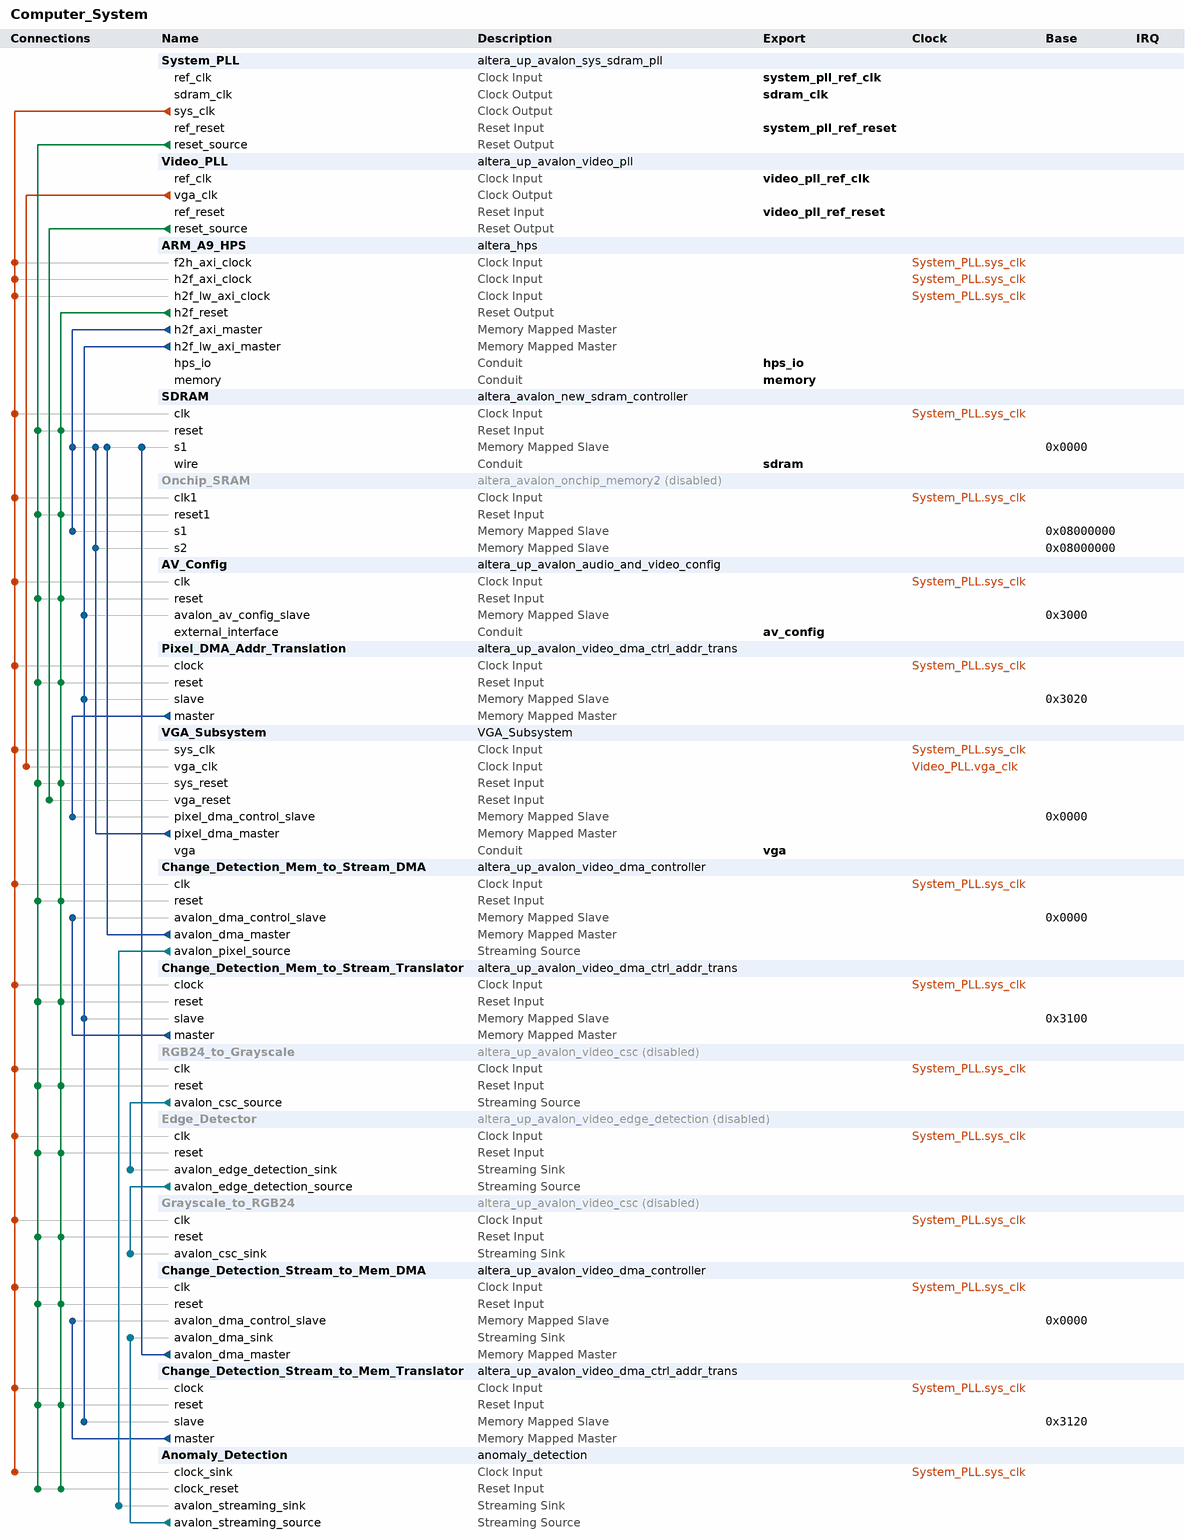
[diagram p0: system contents]
# Platform Designer (Qsys) system Computer_System, Cyclone V 5CSXFC6D6F31C6
# Parameters at their usual value, and those the tool derives, are not listed.
package require -exact qsys 18.0
create_system Computer_System
set_project_property DEVICE_FAMILY {Cyclone V}
set_project_property DEVICE 5CSXFC6D6F31C6

add_instance System_PLL altera_up_avalon_sys_sdram_pll 18.0
set_instance_parameter_value System_PLL CV_boards DE1-SoC
set_instance_parameter_value System_PLL gui_outclk 100.0
set_instance_parameter_value System_PLL gui_refclk 50.0

add_instance Video_PLL altera_up_avalon_video_pll 18.0
set_instance_parameter_value Video_PLL camera {5MP Digital Camera (THDB_D5M)}
set_instance_parameter_value Video_PLL gui_refclk 50.0
set_instance_parameter_value Video_PLL lcd {2.4" LCD on LT24}

add_instance ARM_A9_HPS altera_hps 18.1
set_instance_parameter_value ARM_A9_HPS EMAC1_Mode RGMII
set_instance_parameter_value ARM_A9_HPS EMAC1_PinMuxing {HPS I/O Set 0}
set_instance_parameter_value ARM_A9_HPS F2SCLK_COLDRST_Enable false
set_instance_parameter_value ARM_A9_HPS F2SCLK_DBGRST_Enable false
set_instance_parameter_value ARM_A9_HPS F2SCLK_WARMRST_Enable false
set_instance_parameter_value ARM_A9_HPS F2SINTERRUPT_Enable true
set_instance_parameter_value ARM_A9_HPS F2S_Width 2
set_instance_parameter_value ARM_A9_HPS FPGA_PERIPHERAL_OUTPUT_CLOCK_FREQ_EMAC0_GTX_CLK 100
set_instance_parameter_value ARM_A9_HPS FPGA_PERIPHERAL_OUTPUT_CLOCK_FREQ_EMAC0_MD_CLK 100.0
set_instance_parameter_value ARM_A9_HPS FPGA_PERIPHERAL_OUTPUT_CLOCK_FREQ_EMAC1_GTX_CLK 100
set_instance_parameter_value ARM_A9_HPS FPGA_PERIPHERAL_OUTPUT_CLOCK_FREQ_EMAC1_MD_CLK 100.0
set_instance_parameter_value ARM_A9_HPS HPS_PROTOCOL DDR3
set_instance_parameter_value ARM_A9_HPS I2C0_Mode I2C
set_instance_parameter_value ARM_A9_HPS I2C0_PinMuxing {HPS I/O Set 0}
set_instance_parameter_value ARM_A9_HPS I2C1_Mode I2C
set_instance_parameter_value ARM_A9_HPS I2C1_PinMuxing {HPS I/O Set 0}
set_instance_parameter_value ARM_A9_HPS LWH2F_Enable true
set_instance_parameter_value ARM_A9_HPS MEM_BANKADDR_WIDTH 3
set_instance_parameter_value ARM_A9_HPS MEM_CLK_FREQ 400.0
set_instance_parameter_value ARM_A9_HPS MEM_COL_ADDR_WIDTH 10
set_instance_parameter_value ARM_A9_HPS MEM_DQ_WIDTH 32
set_instance_parameter_value ARM_A9_HPS MEM_DRV_STR RZQ/6
set_instance_parameter_value ARM_A9_HPS MEM_ROW_ADDR_WIDTH 15
set_instance_parameter_value ARM_A9_HPS MEM_RTT_NOM RZQ/6
set_instance_parameter_value ARM_A9_HPS MEM_RTT_WR {Dynamic ODT off}
set_instance_parameter_value ARM_A9_HPS MEM_TCL 11
set_instance_parameter_value ARM_A9_HPS MEM_TFAW_NS 45.0
set_instance_parameter_value ARM_A9_HPS MEM_TRAS_NS 35.0
set_instance_parameter_value ARM_A9_HPS MEM_TRCD_NS 13.75
set_instance_parameter_value ARM_A9_HPS MEM_TRFC_NS 260.0
set_instance_parameter_value ARM_A9_HPS MEM_TRP_NS 13.75
set_instance_parameter_value ARM_A9_HPS MEM_VENDOR Micron
set_instance_parameter_value ARM_A9_HPS MEM_WTCL 7
set_instance_parameter_value ARM_A9_HPS QSPI_Mode {1 SS}
set_instance_parameter_value ARM_A9_HPS QSPI_PinMuxing {HPS I/O Set 0}
set_instance_parameter_value ARM_A9_HPS REF_CLK_FREQ 25.0
set_instance_parameter_value ARM_A9_HPS S2FCLK_USER2CLK 5
set_instance_parameter_value ARM_A9_HPS S2F_Width 2
set_instance_parameter_value ARM_A9_HPS SDIO_Mode {4-bit Data}
set_instance_parameter_value ARM_A9_HPS SDIO_PinMuxing {HPS I/O Set 0}
set_instance_parameter_value ARM_A9_HPS SPIM0_Mode {Single Slave Select}
set_instance_parameter_value ARM_A9_HPS SPIM0_PinMuxing {HPS I/O Set 0}
set_instance_parameter_value ARM_A9_HPS SPIM1_Mode {Single Slave Select}
set_instance_parameter_value ARM_A9_HPS SPIM1_PinMuxing {HPS I/O Set 0}
set_instance_parameter_value ARM_A9_HPS STM_Enable true
set_instance_parameter_value ARM_A9_HPS TIMING_BOARD_AC_SKEW 0.02
set_instance_parameter_value ARM_A9_HPS TIMING_BOARD_AC_TO_CK_SKEW 0.01
set_instance_parameter_value ARM_A9_HPS TIMING_BOARD_DQ_TO_DQS_SKEW 0.05
set_instance_parameter_value ARM_A9_HPS TIMING_BOARD_MAX_CK_DELAY 0.03
set_instance_parameter_value ARM_A9_HPS TIMING_BOARD_MAX_DQS_DELAY 0.02
set_instance_parameter_value ARM_A9_HPS TIMING_BOARD_SKEW_BETWEEN_DQS 0.06
set_instance_parameter_value ARM_A9_HPS TIMING_BOARD_SKEW_CKDQS_DIMM_MAX 0.12
set_instance_parameter_value ARM_A9_HPS TIMING_BOARD_SKEW_CKDQS_DIMM_MIN 0.06
set_instance_parameter_value ARM_A9_HPS TIMING_BOARD_SKEW_WITHIN_DQS 0.01
set_instance_parameter_value ARM_A9_HPS TIMING_TDH 65
set_instance_parameter_value ARM_A9_HPS TIMING_TDQSCK 255
set_instance_parameter_value ARM_A9_HPS TIMING_TDQSQ 125
set_instance_parameter_value ARM_A9_HPS TIMING_TDS 30
set_instance_parameter_value ARM_A9_HPS TIMING_TIH 140
set_instance_parameter_value ARM_A9_HPS TIMING_TIS 190
set_instance_parameter_value ARM_A9_HPS TIMING_TQSH 0.4
set_instance_parameter_value ARM_A9_HPS UART0_Mode {No Flow Control}
set_instance_parameter_value ARM_A9_HPS UART0_PinMuxing {HPS I/O Set 0}
set_instance_parameter_value ARM_A9_HPS USB1_Mode SDR
set_instance_parameter_value ARM_A9_HPS USB1_PinMuxing {HPS I/O Set 0}
set_instance_parameter_value ARM_A9_HPS desired_cfg_clk_mhz 100.0
set_instance_parameter_value ARM_A9_HPS desired_qspi_clk_mhz 400.0

add_instance SDRAM altera_avalon_new_sdram_controller 18.1
set_instance_parameter_value SDRAM TAC 5.5
set_instance_parameter_value SDRAM TRCD 20.0
set_instance_parameter_value SDRAM TRP 20.0
set_instance_parameter_value SDRAM casLatency 3
set_instance_parameter_value SDRAM columnWidth 10
set_instance_parameter_value SDRAM dataWidth 16
set_instance_parameter_value SDRAM generateSimulationModel true
set_instance_parameter_value SDRAM model single_Micron_MT48LC4M32B2_7_chip
set_instance_parameter_value SDRAM numberOfBanks 4
set_instance_parameter_value SDRAM numberOfChipSelects 1
set_instance_parameter_value SDRAM powerUpDelay 100.0
set_instance_parameter_value SDRAM refreshPeriod 15.625
set_instance_parameter_value SDRAM rowWidth 13

add_instance Onchip_SRAM altera_avalon_onchip_memory2 18.1
set_instance_property Onchip_SRAM ENABLED false
set_instance_parameter_value Onchip_SRAM dataWidth 32
set_instance_parameter_value Onchip_SRAM dualPort true
set_instance_parameter_value Onchip_SRAM initMemContent true
set_instance_parameter_value Onchip_SRAM initializationFileName onchip_mem.hex
set_instance_parameter_value Onchip_SRAM memorySize 262144
set_instance_parameter_value Onchip_SRAM singleClockOperation true

add_instance AV_Config altera_up_avalon_audio_and_video_config 18.0
set_instance_parameter_value AV_Config audio_in {Microphone to ADC}
set_instance_parameter_value AV_Config bit_length 32
set_instance_parameter_value AV_Config board DE10-Standard
set_instance_parameter_value AV_Config dac_enable false
set_instance_parameter_value AV_Config line_in_bypass false
set_instance_parameter_value AV_Config sampling_rate {48 kHz}

add_instance Pixel_DMA_Addr_Translation altera_up_avalon_video_dma_ctrl_addr_trans 18.0

add_instance VGA_Subsystem VGA_Subsystem 1.0

add_instance Change_Detection_Mem_to_Stream_DMA altera_up_avalon_video_dma_controller 18.0
set_instance_parameter_value Change_Detection_Mem_to_Stream_DMA addr_mode Consecutive
set_instance_parameter_value Change_Detection_Mem_to_Stream_DMA back_start_address 0
set_instance_parameter_value Change_Detection_Mem_to_Stream_DMA color_bits 16
set_instance_parameter_value Change_Detection_Mem_to_Stream_DMA color_planes 1
set_instance_parameter_value Change_Detection_Mem_to_Stream_DMA dma_enabled false
set_instance_parameter_value Change_Detection_Mem_to_Stream_DMA height 500
set_instance_parameter_value Change_Detection_Mem_to_Stream_DMA mode {From Memory to Stream}
set_instance_parameter_value Change_Detection_Mem_to_Stream_DMA start_address 0
set_instance_parameter_value Change_Detection_Mem_to_Stream_DMA width 500

add_instance Change_Detection_Mem_to_Stream_Translator altera_up_avalon_video_dma_ctrl_addr_trans 18.0

add_instance RGB24_to_Grayscale altera_up_avalon_video_csc 18.0
set_instance_property RGB24_to_Grayscale ENABLED false
set_instance_parameter_value RGB24_to_Grayscale csc_type {24-bit RGB to Grayscale (Y)}

add_instance Edge_Detector altera_up_avalon_video_edge_detection 18.0
set_instance_property Edge_Detector ENABLED false
set_instance_parameter_value Edge_Detector intensity 1
set_instance_parameter_value Edge_Detector width 640

add_instance Grayscale_to_RGB24 altera_up_avalon_video_csc 18.0
set_instance_property Grayscale_to_RGB24 ENABLED false
set_instance_parameter_value Grayscale_to_RGB24 csc_type {Grayscale (Y) to 24-bit RGB}

add_instance Change_Detection_Stream_to_Mem_DMA altera_up_avalon_video_dma_controller 18.0
set_instance_parameter_value Change_Detection_Stream_to_Mem_DMA addr_mode Consecutive
set_instance_parameter_value Change_Detection_Stream_to_Mem_DMA back_start_address 33554432
set_instance_parameter_value Change_Detection_Stream_to_Mem_DMA color_bits 16
set_instance_parameter_value Change_Detection_Stream_to_Mem_DMA color_planes 1
set_instance_parameter_value Change_Detection_Stream_to_Mem_DMA dma_enabled false
set_instance_parameter_value Change_Detection_Stream_to_Mem_DMA height 500
set_instance_parameter_value Change_Detection_Stream_to_Mem_DMA mode {From Stream to Memory}
set_instance_parameter_value Change_Detection_Stream_to_Mem_DMA start_address 33554432
set_instance_parameter_value Change_Detection_Stream_to_Mem_DMA width 500

add_instance Change_Detection_Stream_to_Mem_Translator altera_up_avalon_video_dma_ctrl_addr_trans 18.0

add_instance Anomaly_Detection anomaly_detection 1.0
set_instance_parameter_value Anomaly_Detection ADDR_SIZE 16
set_instance_parameter_value Anomaly_Detection COUNT_WIDTH 9
set_instance_parameter_value Anomaly_Detection IM_SIZE 500
set_instance_parameter_value Anomaly_Detection WORD_SIZE 16

# connections
add_connection System_PLL.sys_clk Anomaly_Detection.clock_sink clock
add_connection System_PLL.sys_clk ARM_A9_HPS.f2h_axi_clock clock
add_connection System_PLL.sys_clk ARM_A9_HPS.h2f_axi_clock clock
add_connection System_PLL.sys_clk ARM_A9_HPS.h2f_lw_axi_clock clock
add_connection System_PLL.sys_clk AV_Config.clk clock
add_connection System_PLL.sys_clk Change_Detection_Mem_to_Stream_DMA.clk clock
add_connection System_PLL.sys_clk Change_Detection_Mem_to_Stream_Translator.clock clock
add_connection System_PLL.sys_clk Change_Detection_Stream_to_Mem_DMA.clk clock
add_connection System_PLL.sys_clk Change_Detection_Stream_to_Mem_Translator.clock clock
add_connection System_PLL.sys_clk Edge_Detector.clk clock
add_connection System_PLL.sys_clk Grayscale_to_RGB24.clk clock
add_connection System_PLL.sys_clk Onchip_SRAM.clk1 clock
add_connection System_PLL.sys_clk Pixel_DMA_Addr_Translation.clock clock
add_connection System_PLL.sys_clk RGB24_to_Grayscale.clk clock
add_connection System_PLL.sys_clk SDRAM.clk clock
add_connection System_PLL.sys_clk VGA_Subsystem.sys_clk clock
add_connection Video_PLL.vga_clk VGA_Subsystem.vga_clk clock
add_connection ARM_A9_HPS.h2f_reset Anomaly_Detection.clock_reset reset
add_connection ARM_A9_HPS.h2f_reset AV_Config.reset reset
add_connection ARM_A9_HPS.h2f_reset Change_Detection_Mem_to_Stream_DMA.reset reset
add_connection ARM_A9_HPS.h2f_reset Change_Detection_Mem_to_Stream_Translator.reset reset
add_connection ARM_A9_HPS.h2f_reset Change_Detection_Stream_to_Mem_DMA.reset reset
add_connection ARM_A9_HPS.h2f_reset Change_Detection_Stream_to_Mem_Translator.reset reset
add_connection ARM_A9_HPS.h2f_reset Edge_Detector.reset reset
add_connection ARM_A9_HPS.h2f_reset Grayscale_to_RGB24.reset reset
add_connection ARM_A9_HPS.h2f_reset Onchip_SRAM.reset1 reset
add_connection ARM_A9_HPS.h2f_reset Pixel_DMA_Addr_Translation.reset reset
add_connection ARM_A9_HPS.h2f_reset RGB24_to_Grayscale.reset reset
add_connection ARM_A9_HPS.h2f_reset SDRAM.reset reset
add_connection ARM_A9_HPS.h2f_reset VGA_Subsystem.sys_reset reset
add_connection System_PLL.reset_source Anomaly_Detection.clock_reset reset
add_connection System_PLL.reset_source AV_Config.reset reset
add_connection System_PLL.reset_source Change_Detection_Mem_to_Stream_DMA.reset reset
add_connection System_PLL.reset_source Change_Detection_Mem_to_Stream_Translator.reset reset
add_connection System_PLL.reset_source Change_Detection_Stream_to_Mem_DMA.reset reset
add_connection System_PLL.reset_source Change_Detection_Stream_to_Mem_Translator.reset reset
add_connection System_PLL.reset_source Edge_Detector.reset reset
add_connection System_PLL.reset_source Grayscale_to_RGB24.reset reset
add_connection System_PLL.reset_source Onchip_SRAM.reset1 reset
add_connection System_PLL.reset_source Pixel_DMA_Addr_Translation.reset reset
add_connection System_PLL.reset_source RGB24_to_Grayscale.reset reset
add_connection System_PLL.reset_source SDRAM.reset reset
add_connection System_PLL.reset_source VGA_Subsystem.sys_reset reset
add_connection Video_PLL.reset_source VGA_Subsystem.vga_reset reset
add_connection ARM_A9_HPS.h2f_axi_master Onchip_SRAM.s1 avalon
set_connection_parameter_value ARM_A9_HPS.h2f_axi_master/Onchip_SRAM.s1 baseAddress 0x08000000
add_connection ARM_A9_HPS.h2f_axi_master SDRAM.s1 avalon
set_connection_parameter_value ARM_A9_HPS.h2f_axi_master/SDRAM.s1 baseAddress 0x0000
add_connection ARM_A9_HPS.h2f_lw_axi_master AV_Config.avalon_av_config_slave avalon
set_connection_parameter_value ARM_A9_HPS.h2f_lw_axi_master/AV_Config.avalon_av_config_slave baseAddress 0x3000
add_connection ARM_A9_HPS.h2f_lw_axi_master Change_Detection_Mem_to_Stream_Translator.slave avalon
set_connection_parameter_value ARM_A9_HPS.h2f_lw_axi_master/Change_Detection_Mem_to_Stream_Translator.slave baseAddress 0x3100
add_connection ARM_A9_HPS.h2f_lw_axi_master Change_Detection_Stream_to_Mem_Translator.slave avalon
set_connection_parameter_value ARM_A9_HPS.h2f_lw_axi_master/Change_Detection_Stream_to_Mem_Translator.slave baseAddress 0x3120
add_connection ARM_A9_HPS.h2f_lw_axi_master Pixel_DMA_Addr_Translation.slave avalon
set_connection_parameter_value ARM_A9_HPS.h2f_lw_axi_master/Pixel_DMA_Addr_Translation.slave baseAddress 0x3020
add_connection Change_Detection_Mem_to_Stream_DMA.avalon_dma_master SDRAM.s1 avalon
set_connection_parameter_value Change_Detection_Mem_to_Stream_DMA.avalon_dma_master/SDRAM.s1 baseAddress 0x0000
add_connection Change_Detection_Mem_to_Stream_Translator.master Change_Detection_Mem_to_Stream_DMA.avalon_dma_control_slave avalon
set_connection_parameter_value Change_Detection_Mem_to_Stream_Translator.master/Change_Detection_Mem_to_Stream_DMA.avalon_dma_control_slave baseAddress 0x0000
add_connection Change_Detection_Stream_to_Mem_DMA.avalon_dma_master SDRAM.s1 avalon
set_connection_parameter_value Change_Detection_Stream_to_Mem_DMA.avalon_dma_master/SDRAM.s1 baseAddress 0x0000
add_connection Change_Detection_Stream_to_Mem_Translator.master Change_Detection_Stream_to_Mem_DMA.avalon_dma_control_slave avalon
set_connection_parameter_value Change_Detection_Stream_to_Mem_Translator.master/Change_Detection_Stream_to_Mem_DMA.avalon_dma_control_slave baseAddress 0x0000
add_connection Pixel_DMA_Addr_Translation.master VGA_Subsystem.pixel_dma_control_slave avalon
set_connection_parameter_value Pixel_DMA_Addr_Translation.master/VGA_Subsystem.pixel_dma_control_slave baseAddress 0x0000
add_connection VGA_Subsystem.pixel_dma_master Onchip_SRAM.s2 avalon
set_connection_parameter_value VGA_Subsystem.pixel_dma_master/Onchip_SRAM.s2 baseAddress 0x08000000
add_connection VGA_Subsystem.pixel_dma_master SDRAM.s1 avalon
set_connection_parameter_value VGA_Subsystem.pixel_dma_master/SDRAM.s1 baseAddress 0x0000
add_connection Anomaly_Detection.avalon_streaming_source Change_Detection_Stream_to_Mem_DMA.avalon_dma_sink avalon_streaming
add_connection Change_Detection_Mem_to_Stream_DMA.avalon_pixel_source Anomaly_Detection.avalon_streaming_sink avalon_streaming
add_connection Edge_Detector.avalon_edge_detection_source Grayscale_to_RGB24.avalon_csc_sink avalon_streaming
add_connection RGB24_to_Grayscale.avalon_csc_source Edge_Detector.avalon_edge_detection_sink avalon_streaming

# exported interfaces
add_interface av_config conduit end
set_interface_property av_config EXPORT_OF AV_Config.external_interface
add_interface hps_io conduit end
set_interface_property hps_io EXPORT_OF ARM_A9_HPS.hps_io
add_interface memory conduit end
set_interface_property memory EXPORT_OF ARM_A9_HPS.memory
add_interface sdram conduit end
set_interface_property sdram EXPORT_OF SDRAM.wire
add_interface sdram_clk clock source
set_interface_property sdram_clk EXPORT_OF System_PLL.sdram_clk
add_interface system_pll_ref_clk clock sink
set_interface_property system_pll_ref_clk EXPORT_OF System_PLL.ref_clk
add_interface system_pll_ref_reset reset sink
set_interface_property system_pll_ref_reset EXPORT_OF System_PLL.ref_reset
add_interface vga conduit end
set_interface_property vga EXPORT_OF VGA_Subsystem.vga
add_interface video_pll_ref_clk clock sink
set_interface_property video_pll_ref_clk EXPORT_OF Video_PLL.ref_clk
add_interface video_pll_ref_reset reset sink
set_interface_property video_pll_ref_reset EXPORT_OF Video_PLL.ref_reset

set_interconnect_requirement {$system} qsys_mm.clockCrossingAdapter HANDSHAKE
set_interconnect_requirement {$system} qsys_mm.enableEccProtection FALSE
set_interconnect_requirement {$system} qsys_mm.insertDefaultSlave FALSE
set_interconnect_requirement {$system} qsys_mm.maxAdditionalLatency 1

save_system Computer_System.qsys
